# EAGLE schematic xu1541 (EAGLE 4.11)
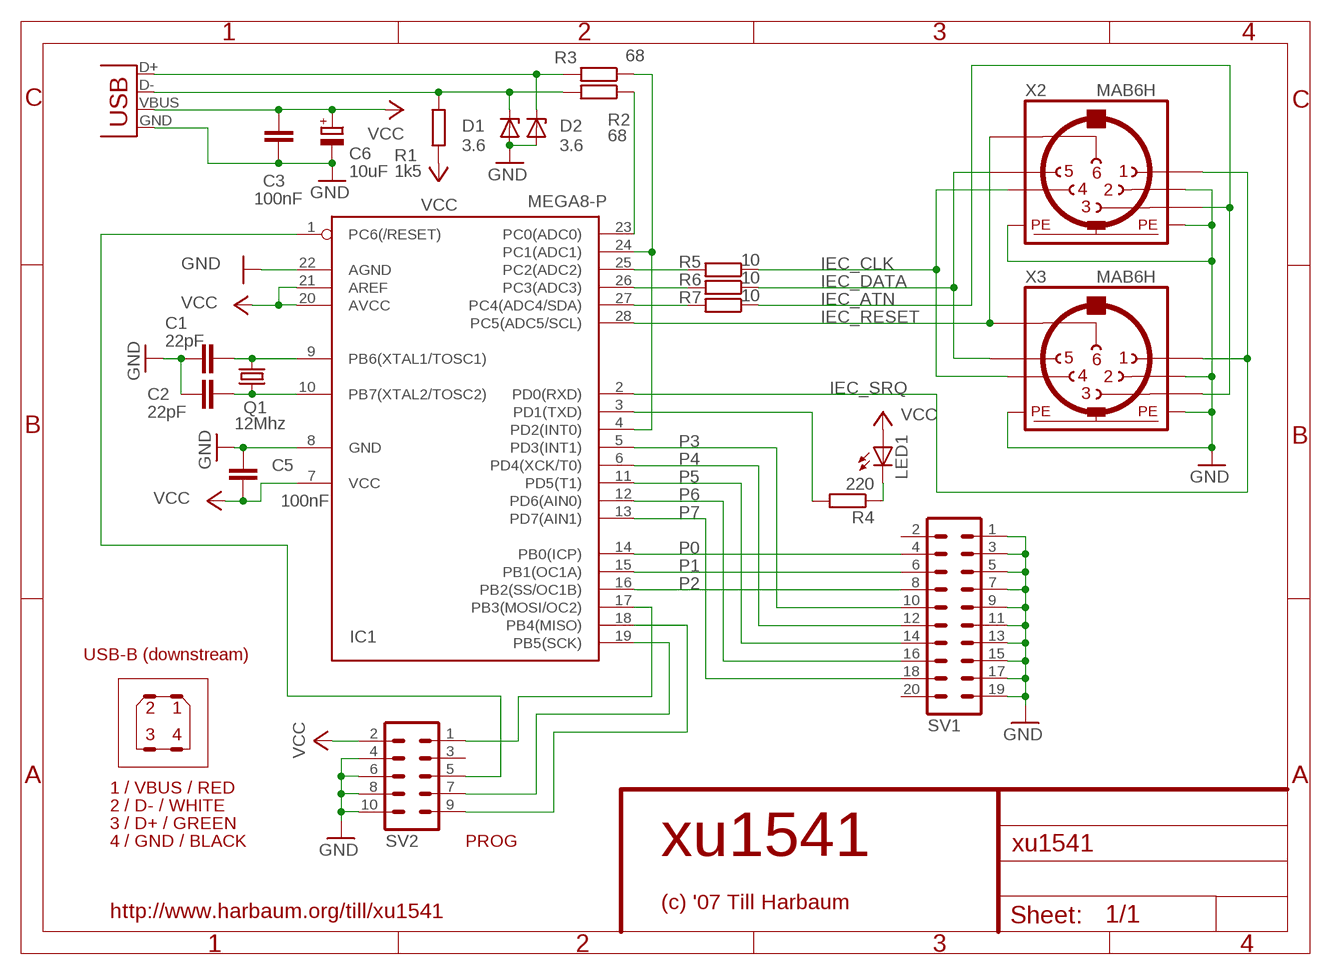
[diagram p0: schematic, sheet 1]

## Parts
C1  22pF  C-EU025-025X050  [C025-025X050]
C2  22pF  C-EU025-025X050  [C025-025X050]
C3  100nF  C-EU050-025X075  [C050-025X075]
C5  100nF  C-EU050-025X075  [C050-025X075]
C6  10uF  CPOL-EUTT2D5L  [TT2D5L]
D1  3.6  ZENER-DIODEDO35Z10  [DO35Z10]
D2  3.6  ZENER-DIODEDO35Z10  [DO35Z10]
IC1  MEGA8-P  [DIL28-3]
LED1  LED3MM  [LED3MM]
Q1  12Mhz  CRYTALHC49S  [HC49/S]
R1  1k5  R-EU_0207/10  [0207/10]
R2  68  R-EU_0207/10  [0207/10]
R3  68  R-EU_0207/10  [0207/10]
R4  220  R-EU_0207/10  [0207/10]
R5  10  R-EU_0207/10  [0207/10]
R6  10  R-EU_0207/10  [0207/10]
R7  10  R-EU_0207/10  [0207/10]
SV1  ML20  [ML20]
SV2  ML10  [ML10]
X1  USB-B-H  [USB-B-H]
X2  MAB6H  [MAB6H]
X3  MAB6H  [MAB6H]

## Nets
/LED: IC1.3(PD1(TXD)) R4.2
GND: C1.1 C2.1 C3.2 C5.1 C6.- D1.A D2.A IC1.8(GND) IC1.22(AGND) SV1.1 SV1.3 SV1.5 SV1.7 SV1.9 SV1.11 SV1.13 SV1.15 SV1.17 SV1.19 SV2.4 SV2.6 SV2.8 SV2.10 X1.GND X2.2 X2.PE X2.PE@(PE) X3.2 X3.PE X3.PE@(PE)
IEC_ATN: R7.1 X2.3 X3.3
IEC_CLK: R5.1 X2.4 X3.4
IEC_DATA: R6.1 X2.5 X3.5
IEC_RESET: IC1.28(PC5(ADC5/SCL)) X2.6 X3.6
IEC_SRQ: IC1.2(PD0(RXD)) X2.1 X3.1
N$1: C1.2 IC1.9(PB6(XTAL1/TOSC1)) Q1.2
N$2: C2.2 IC1.10(PB7(XTAL2/TOSC2)) Q1.1
N$3: IC1.25(PC2(ADC2)) R5.2
N$4: IC1.26(PC3(ADC3)) R6.2
N$5: D1.C R1.1 R2.2 X1.D-
N$6: D2.C R3.2 X1.D+
N$7: IC1.27(PC4(ADC4/SDA)) R7.2
N$8: IC1.23(PC0(ADC0)) R2.1
N$9: IC1.4(PD2(INT0)) IC1.24(PC1(ADC1)) R3.1
N$10: IC1.17(PB3(MOSI/OC2)) SV2.1
N$11: IC1.1(PC6(/RESET)) SV2.5
N$12: IC1.19(PB5(SCK)) SV2.7
N$13: IC1.18(PB4(MISO)) SV2.9
N$14: LED1.K(C) R4.1
P0: IC1.14(PB0(ICP)) SV1.4
P1: IC1.15(PB1(OC1A)) SV1.6
P2: IC1.16(PB2(SS/OC1B)) SV1.8
P3: IC1.5(PD3(INT1)) SV1.10
P4: IC1.6(PD4(XCK/T0)) SV1.12
P5: IC1.11(PD5(T1)) SV1.14
P6: IC1.12(PD6(AIN0)) SV1.16
P7: IC1.13(PD7(AIN1)) SV1.18
VCC: C3.1 C5.2 C6.+ IC1.7(VCC) IC1.20(AVCC) IC1.21(AREF) LED1.A R1.2 SV2.2 X1.VBUS
Unconnected: SV1.2 SV1.20 SV2.3

## Notes on the sheet
- USB-B (downstream)
- 2 | 1
- 3 | 4
- 1 / VBUS / RED
- 2 / D- / WHITE
- 3 / D+ / GREEN
- 4 / GND / BLACK | PROG
- xu1541
- (c) '07 Till Harbaum
- http://www.harbaum.org/till/xu1541

## Library data of the parts
C1-C3 C5 = rcl:C-EU: CAPACITOR, European symbol
C6 = rcl:CPOL-EU: POLARIZED CAPACITOR, European symbol
D1 D2 = diode:ZENER-DIODE: Z-Diode
IC1 = avr:MEGA8-P: MICROCONTROLLER 8 Kbytes FLASH 1 kbytes SRAM 512 bytes EEPROM USART 4-channel 10 bit ADC 2-channel 8 bit ADC
LED1 = led:LED: LED OSRAM: - CHIPLED LG R971, LG N971, LY N971, LG Q971, LY Q971, LO R971, LY R971 LH N974, LH R974 LS Q976, LO Q976, LY Q976 LO Q996 - Hyper CHIPLED LW Q18S LB Q993, LB Q99A, LB R99A - SideLED LS A670, LO A670, LY A670, LG A670, LP A670 LB A673, LV A673, LT A673, LW A673 LH A674 LY A675 LS A676, LA A676, LO A676, LY A676, LW A676 LS A679, LY A679, LG A679 - Hyper Micro SIDELED® LS Y876, LA Y876, LO Y876, LY Y876 LT Y87S - SmartLED LW L88C, LW L88S LB L89C, LB L89S, LG L890 LS L89K, LO L89K, LY L89K LS L896, LA L896, LO L896, LY L896 - TOPLED LS T670, LO T670, LY T670, LG T670, LP T670 LSG T670, LSP T670, LSY T670, LOP T670, LYG T670 LG T671, LOG T671, LSG T671 LB T673, LV T673, LT T673, LW T673 LH T674 LS T676, LA T676, LO T676, LY T676, LB T676, LH T676, LSB T676, LW T676 LB T67C, LV T67C, LT T67C, LS T67K, LO T67K, LY T67K, LW E67C LS E67B, LA E67B, LO E67B, LY E67B, LB E67C, LV E67C, LT E67C LW T67C LS T679, LY T679, LG T679 LS T770, LO T770, LY T770, LG T770, LP T770 LB T773, LV T773, LT T773, LW T773 LH T774 LS E675, LA E675, LY E675, LS T675 LS T776, LA T776, LO T776, LY T776, LB T776 LHGB T686 LT T68C, LB T68C - Hyper Mini TOPLED® LB M676 - Mini TOPLED Santana® LG M470 LS M47K, LO M47K, LY M47K Source: http://www.osram.convergy.de/
Q1 = crystal:CRYTAL: CRYSTAL
R1-R7 = rcl:R-EU_: RESISTOR, European symbol
SV1 = con-harting-ml:ML20: HARTING
SV2 = con-harting-ml:ML10: HARTING
X1 = con-usb:USB: USB Connectors
X2 X3 = con-hirschmann:MAB6H: Female CONNECTOR 6 pins with shield, horizontal (DIN 45322)